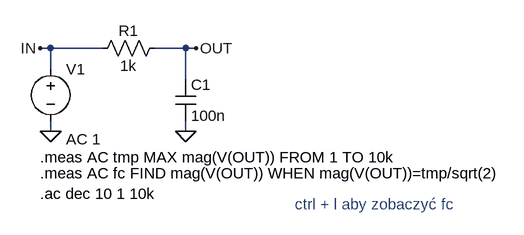
[diagram p0: schematic zad2_lista6.asc]
zad2_lista6.asc, the LTspice schematic file:
Version 4.1
SHEET 1 880 680
WIRE 64 48 48 48
WIRE 144 48 64 48
WIRE 272 48 224 48
WIRE 288 48 272 48
WIRE 64 80 64 48
WIRE 272 96 272 48
WIRE 64 176 64 160
WIRE 272 176 272 160
FLAG 64 176 0
FLAG 272 176 0
FLAG 48 48 IN
FLAG 288 48 OUT
SYMBOL voltage 64 64 R0
WINDOW 123 24 124 Left 2
WINDOW 39 0 0 Left 0
SYMATTR InstName V1
SYMATTR Value ""
SYMATTR Value2 AC 1
SYMBOL res 240 32 R90
WINDOW 0 5 56 VBottom 2
WINDOW 3 27 56 VTop 2
SYMATTR InstName R1
SYMATTR Value 1k
SYMBOL cap 256 96 R0
SYMATTR InstName C1
SYMATTR Value 100n
TEXT 48 216 Left 2 !.meas AC tmp MAX mag(V(OUT)) FROM 1 TO 10k
TEXT 48 240 Left 2 !.meas AC fc FIND mag(V(OUT)) WHEN mag(V(OUT))=tmp/sqrt(2)
TEXT 48 272 Left 2 !.ac dec 10 1 10k
TEXT 440 288 Left 2 ;ctrl + l aby zobaczyć fc

The netlist it stands for:
* zad2_lista6.asc
V1 IN 0 AC 1
R1 OUT IN 1k
C1 OUT 0 100n
.meas AC tmp MAX mag(V(OUT)) FROM 1 TO 10k
.meas AC fc FIND mag(V(OUT)) WHEN mag(V(OUT))=tmp/sqrt(2)
.ac dec 10 1 10k
* ctrl + l aby zobaczyć fc
.backanno
.end